# Altium schematic sheet 2019-02-23_14-12-511.schdoc
size 372 x 177 mm; SheetNumber: 1; SheetTotal: 1
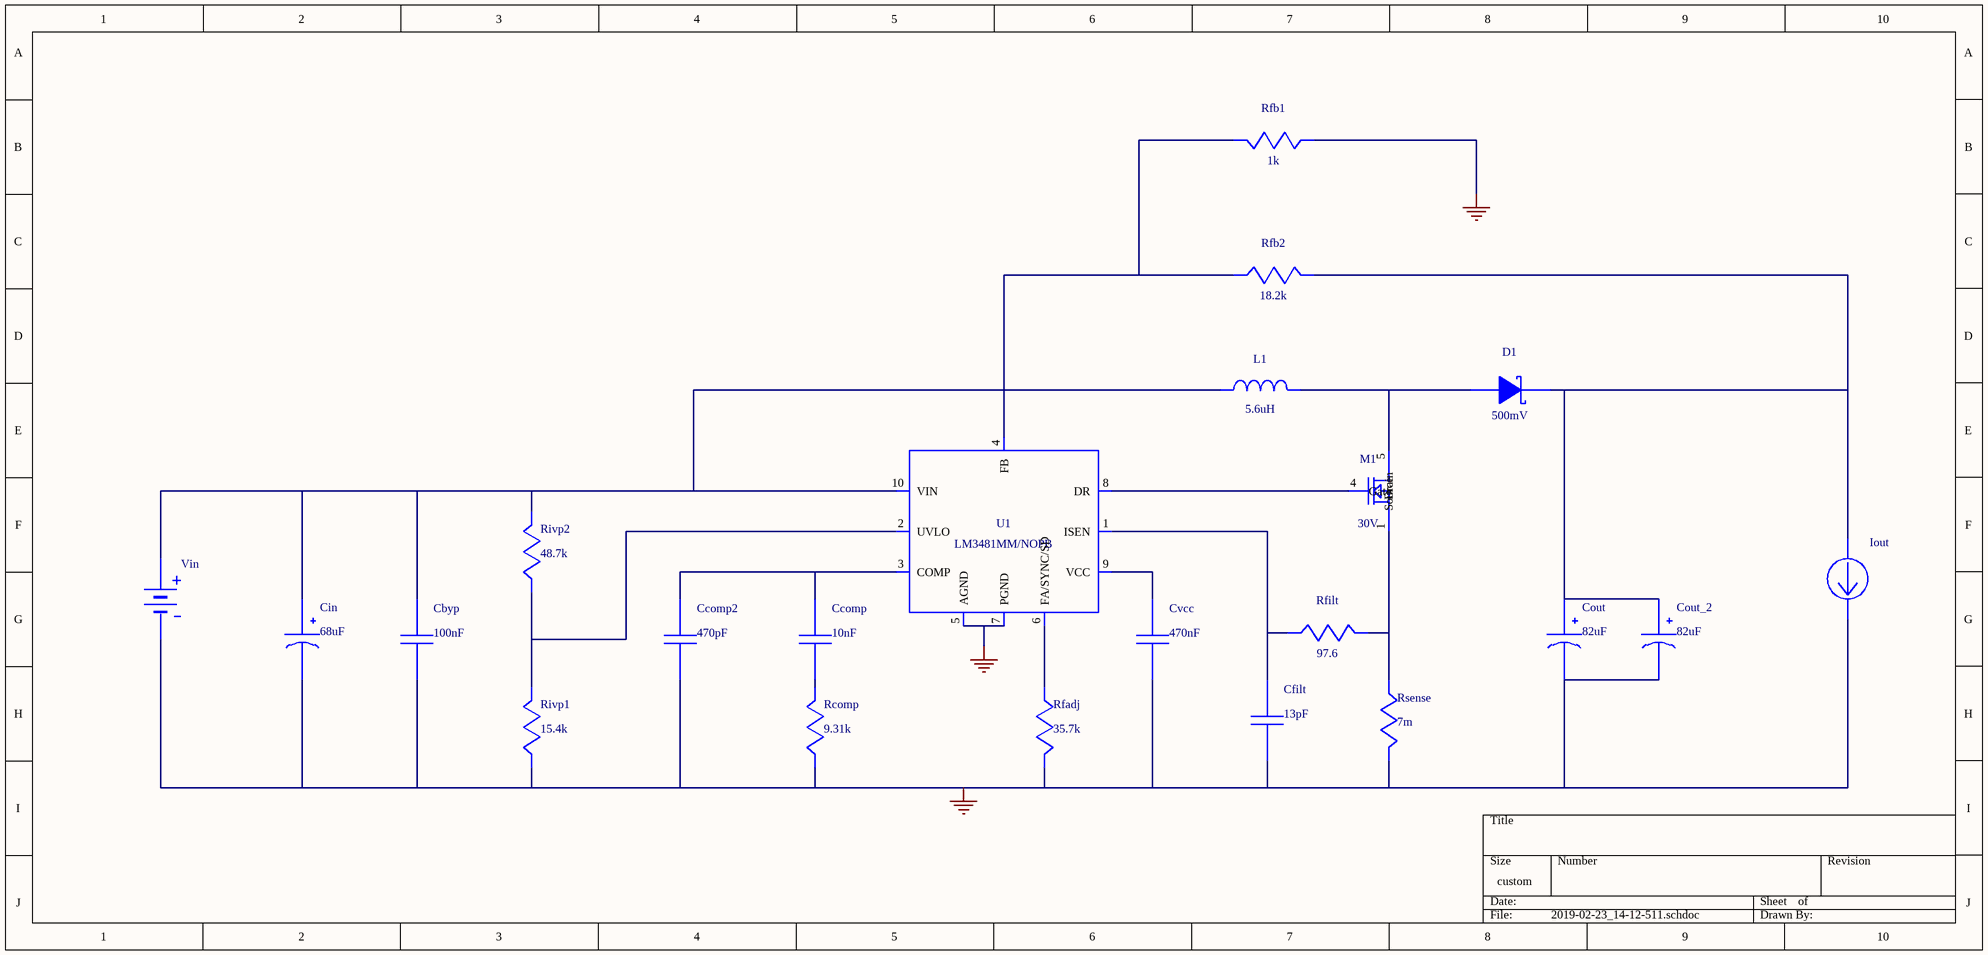
[diagram p0: 2019-02-23_14-12-511.schdoc]

## Parts
Cbyp  value 100nF  (hidden comment: GRM155R71A104KA01D)
Ccomp  value 10nF  (hidden comment: CGA4C2C0G1H103J060AA)
Ccomp2  value 470pF  (hidden comment: CL21C471KBANNNC)
Cfilt  value 13pF  (hidden comment: CL21C130JBANNNC)
Cin  value 68uF  (hidden comment: TPSC686K016R0200)
Cout  value 82uF  (hidden comment: 35SVPF82M)
Cout_2  value 82uF  (hidden comment: 35SVPF82M)
Cvcc  value 470nF  (hidden comment: ECPU1C474MA5)
D1  value 500mV  (hidden comment: B340A-13-F)
Iout  WB_CURRENT_LOAD  (value not drawn)
L1  value 5.6uH  (hidden comment: XAL6060-562MEB)
M1  value 30V  (hidden comment: CSD17304Q3)
Rcomp  value 9.31k  (hidden comment: CRCW04029K31FKED)
Rfadj  value 35.7k  (hidden comment: CRCW040235K7FKED)
Rfb1  value 1k  (hidden comment: ERJ-6ENF1001V)
Rfb2  value 18.2k  (hidden comment: CRCW040218K2FKED)
Rfilt  value 97.6  (hidden comment: CRCW040297R6FKED)
Rivp1  value 15.4k  (hidden comment: RC0201FR-0715K4L)
Rivp2  value 48.7k  (hidden comment: CRCW040248K7FKED)
Rsense  value 7m  (hidden comment: PRL1632-R007-F-T1)
U1  LM3481MM/NOPB
Vin  WB_BATTERY  (value not drawn)

## Nets
0: Cbyp.2 Ccomp2.2 Cfilt.2 Cin.2(-) Cout.2(-) Cout_2.2(-) Cvcc.2 Iout.2(-) Rcomp.2 Rfadj.1 Rfb1.2 Rivp1.2 Rsense.1 U1.5(AGND) U1.7(PGND) Vin.2(-)
NetCbyp_1: Cbyp.1 Cin.1(+) L1.1 Rivp2.1 U1.10(VIN) Vin.1(+)
NetCcomp_1: Ccomp.1 Ccomp2.1 U1.3(COMP)
NetCcomp_2: Ccomp.2 Rcomp.1
NetCfilt_1: Cfilt.1 Rfilt.2 U1.1(ISEN)
NetCout_1: Cout.1(+) Cout_2.1(+) D1.1(K) Iout.1(+) Rfb2.1
NetCvcc_1: Cvcc.1 U1.9(VCC)
NetD1_2: D1.2(A) L1.2 M1.5(Drain) M1.6(Drain) M1.7(Drain) M1.8(Drain) M1.9(Drain)
NetM1_1: M1.1(Source) M1.2(Source) M1.3(Source) Rfilt.1 Rsense.2
NetM1_4: M1.4(Gate) U1.8(DR)
NetRfadj_2: Rfadj.2 U1.6(FA/SYNC/SD)
NetRfb1_1: Rfb1.1 Rfb2.2 U1.4(FB)
NetRivp1_1: Rivp1.1 Rivp2.2 U1.2(UVLO)

## Library data of the parts
Cbyp = GRM155R71A104KA01D: GRM155R71A104KA0; Manufacturer Name: MuRata; PackageReference: GRM155R71A104KA01D; Manufacturer Part Number: GRM155R71A104KA01D
Ccomp = CGA4C2C0G1H103J060AA: CGA4C2C0G1H103J0; Manufacturer Name: TDK; PackageReference: CGA4C2C0G1H103J060AA; Manufacturer Part Number: CGA4C2C0G1H103J060AA
Ccomp2 = CL21C471KBANNNC: Manufacturer Name: Samsung Electro-Mechanics; PackageReference: CL21C471KBANNNC; Manufacturer Part Number: CL21C471KBANNNC
Cfilt = CL21C130JBANNNC: Manufacturer Name: Samsung Electro-Mechanics; PackageReference: CL21C130JBANNNC; Manufacturer Part Number: CL21C130JBANNNC
Cin = TPSC686K016R0200: Manufacturer Name: AVX; PackageReference: TPSC686K016R0200; Manufacturer Part Number: TPSC686K016R0200
Cout Cout_2 = 35SVPF82M: Manufacturer Name: Panasonic; PackageReference: 35SVPF82M; Manufacturer Part Number: 35SVPF82M
Cvcc = ECPU1C474MA5: Manufacturer Name: Panasonic; PackageReference: ECPU1C474MA5; Manufacturer Part Number: ECPU1C474MA5
D1 = B340A-13-F: Manufacturer Name: Diodes Inc.; PackageReference: B340A-13-F; Manufacturer Part Number: B340A-13-F
L1 = XAL6060-562MEB: Manufacturer Name: Coilcraft; PackageReference: XAL6060-562MEB; Manufacturer Part Number: XAL6060-562MEB
M1 = CSD17304Q3: Manufacturer Name: Texas Instruments; PackageReference: CSD17304Q3; Manufacturer Part Number: CSD17304Q3
Rcomp = CRCW04029K31FKED: Manufacturer Name: Vishay-Dale; PackageReference: CRCW04029K31FKED; Manufacturer Part Number: CRCW04029K31FKED
Rfadj = CRCW040235K7FKED: Manufacturer Name: Vishay-Dale; PackageReference: CRCW040235K7FKED; Manufacturer Part Number: CRCW040235K7FKED
Rfb1 = ERJ-6ENF1001V: Manufacturer Name: Panasonic; PackageReference: ERJ-6ENF1001V; Manufacturer Part Number: ERJ-6ENF1001V
Rfb2 = CRCW040218K2FKED: Manufacturer Name: Vishay-Dale; PackageReference: CRCW040218K2FKED; Manufacturer Part Number: CRCW040218K2FKED
Rfilt = CRCW040297R6FKED: Manufacturer Name: Vishay-Dale; PackageReference: CRCW040297R6FKED; Manufacturer Part Number: CRCW040297R6FKED
Rivp1 = RC0201FR-0715K4L: Manufacturer Name: Yageo; PackageReference: RC0201FR-0715K4L; Manufacturer Part Number: RC0201FR-0715K4L
Rivp2 = CRCW040248K7FKED: Manufacturer Name: Vishay-Dale; PackageReference: CRCW040248K7FKED; Manufacturer Part Number: CRCW040248K7FKED
Rsense = PRL1632-R007-F-T1: PRL1632-R007-F-T; Manufacturer Name: Susumu Co Ltd; PackageReference: PRL1632-R007-F-T1; Manufacturer Part Number: PRL1632-R007-F-T1
U1 = LM3481MM/NOPB: Manufacturer Name: Texas Instruments; PackageReference: LM3481MM/NOPB; Manufacturer Part Number: LM3481MM/NOPB; Value: N/A
Iout = WB_CURRENT_LOAD: PackageReference: WB_CURRENT_LOAD; Manufacturer Part Number: WB_CURRENT_LOAD; Manufacturer Name: WB_CURRENT_LOAD; Value: N/A
Vin = WB_BATTERY: PackageReference: WB_BATTERY; Manufacturer Part Number: WB_BATTERY; Manufacturer Name: WB_BATTERY; Value: N/A